# Altium schematic sheet USB-PHY.SchDoc: TE0723 - USB
size A4; Organization: Trenz Electronic GmbH; DocumentNumber: TE0723; Revision: 01; SheetNumber: 9; SheetTotal: 12; Date: 08.07.2015; Author: Indrek Tubalkain; CompanyName: Trenz Electronic GmbH; DrawnBy: Indrek Tubalkain; Engineer: Indrek Tubalkain; ProjectName: TE0723 Arduino
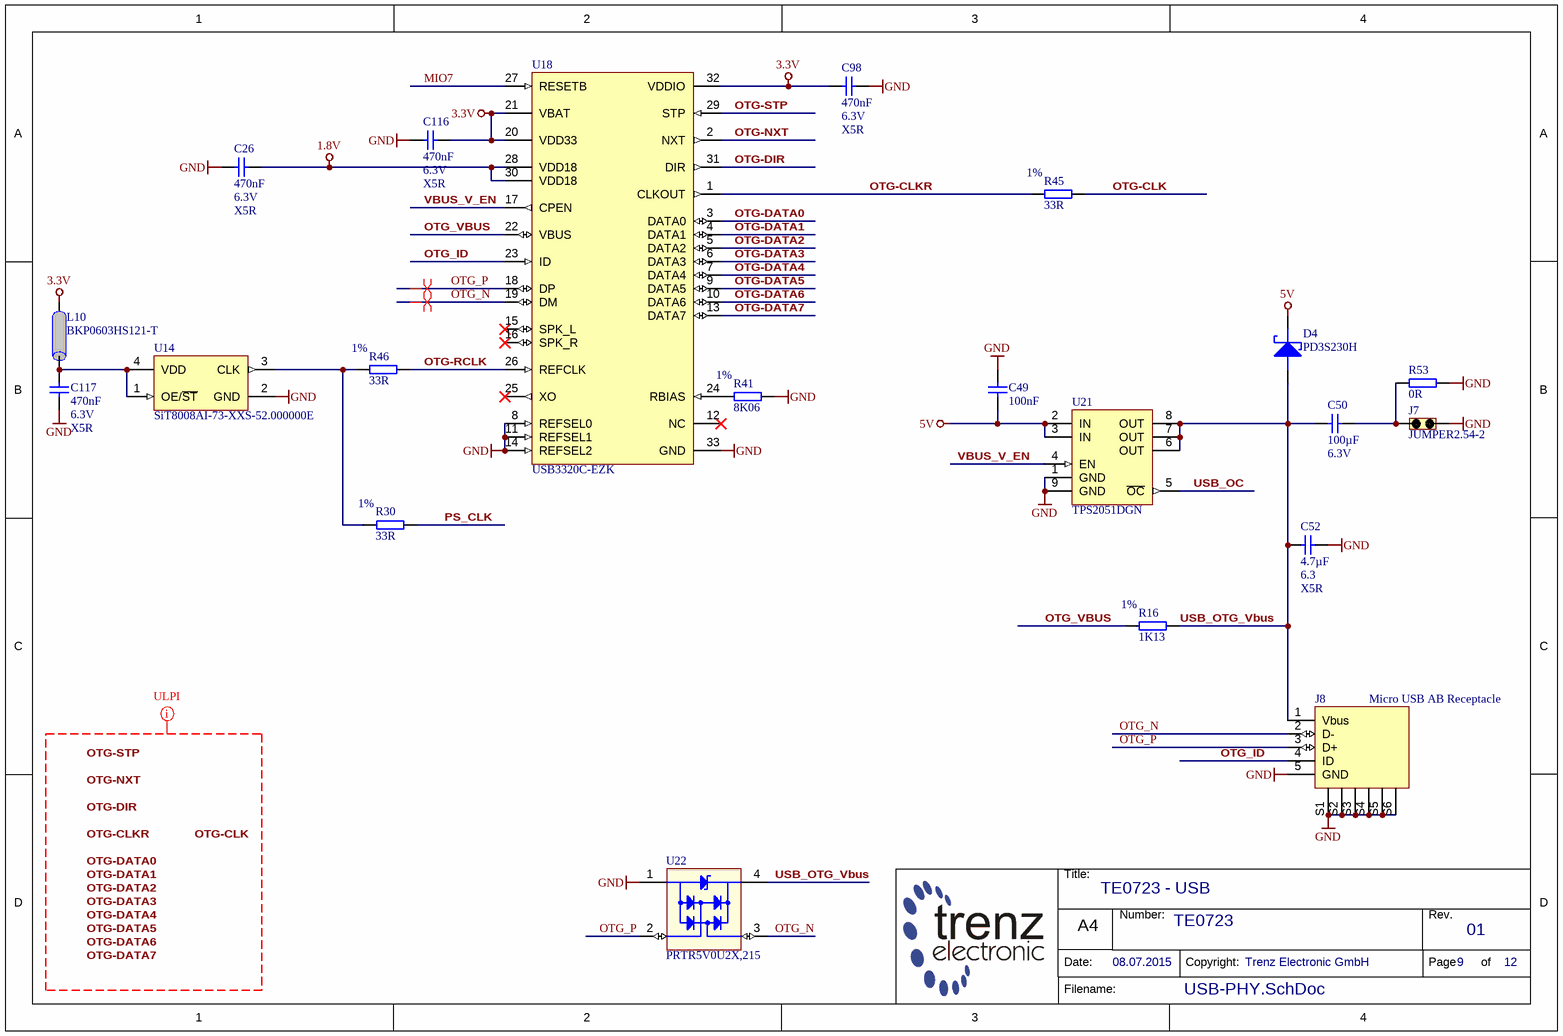
[diagram p0: USB-PHY.SchDoc]

## Parts
C26  470nF  Voltage: 6.3V  Technology: X5R  [CAPC0603X33N]
C49  100nF  [CAPC1005X55N]
C50  100µF  Voltage: 6.3V  [CAPC3216X180N]
C52  4.7µF  Voltage: 6.3  Technology: X5R  [CAPC1005X60N]
C98  470nF  Voltage: 6.3V  Technology: X5R  [CAPC0603X33N]
C116  470nF  Voltage: 6.3V  Technology: X5R  [CAPC0603X33N]
C117  470nF  Voltage: 6.3V  Technology: X5R  [CAPC0603X33N]
D4  PD3S230H  [PowerDI323]
J7  JUMPER2.54-2  [JUMPER2_54-2]
J8  Micro USB AB Receptacle  [Micro USB ZX62-xx-5PA]
L10  BKP0603HS121-T  [INDC0603X33N]
R16  1K13  Tolerance: 1%  [RESC1005X40N]
R30  33R  Tolerance: 1%  [RESC0603X26N]
R41  8K06  Tolerance: 1%  [RESC1005X40N]
R45  33R  Tolerance: 1%  [RESC0603X26N]
R46  33R  Tolerance: 1%  [RESC0603X26N]
R53  0R  [RESC1005X40N]
U14  SiT8008AI-73-XXS-52.000000E  [2016]
U18  USB3320C-EZK  [QFN50P500X500X100-33N-345]
U21  TPS2051DGN  [SOP65P488X107-9N-TI]
U22  PRTR5V0U2X,215  [SOT190P229X114-4N]

## Nets
1.8V: C26.1 U18.28(VDD18) U18.30(VDD18)
3.3V: C98.2 C116.1 L10.1 U18.20(VDD33) U18.21(VBAT) U18.32(VDDIO)
5V: C49.2 D4.1(KATHODE) U21.2(IN) U21.3(IN)
GND: C26.2 C49.1 C52.2 C98.1 C116.2 C117.2 J7.2 J8.5(GND) J8.S1 J8.S2 J8.S3 J8.S4 J8.S5 J8.S6 R41.2 R53.2 U14.2(GND) U18.8(REFSEL0) U18.11(REFSEL1) U18.14(REFSEL2) U18.33(GND) U21.1(GND) U21.9(GND) U22.1(GND)
MIO7: U18.27(RESETB)
OTG-CLK: R45.2
OTG-CLKR: R45.1 U18.1(CLKOUT)
OTG-DATA0: U18.3(DATA0)
OTG-DATA1: U18.4(DATA1)
OTG-DATA2: U18.5(DATA2)
OTG-DATA3: U18.6(DATA3)
OTG-DATA4: U18.7(DATA4)
OTG-DATA5: U18.9(DATA5)
OTG-DATA6: U18.10(DATA6)
OTG-DATA7: U18.13(DATA7)
OTG-DIR: U18.31(DIR)
OTG-NXT: U18.2(NXT)
OTG-RCLK: R46.2 U18.26(REFCLK)
OTG-STP: U18.29(STP)
OTG_ID: J8.4(ID) U18.23(ID)
OTG_N: J8.2(D-) U18.19(DM) U22.3(I/O)
OTG_P: J8.3(D+) U18.18(DP) U22.2(I/O)
OTG_VBUS: R16.1 U18.22(VBUS)
PS_CLK: R30.2
USB_OC: U21.5(~{OC})
USB_OTG_Vbus: C50.2 C52.1 D4.2(ANODE) J8.1(Vbus) R16.2 U21.6(OUT) U21.7(OUT) U21.8(OUT) U22.4(REF)
VBUS_V_EN: U18.17(CPEN) U21.4(EN)
NetC50_1: C50.1 J7.1 R53.1
NetC117_1: C117.1 L10.2 U14.1(OE/~{ST}) U14.4(VDD)
NetR30_1: R30.1 R46.1 U14.3(CLK)
NetR41_1: R41.1 U18.24(RBIAS)

Not connected (* = marked no-connect by the designer): U18 12(NC)* 15(SPK_L)* 16(SPK_R)* 25(XO)*

## Layout directives
differential pair: OTG_N, OTG_P
net class ULPI: OTG-CLK, OTG-CLKR, OTG-DATA0, OTG-DATA1, OTG-DATA2, OTG-DATA3, OTG-DATA4, OTG-DATA5, OTG-DATA6, OTG-DATA7, OTG-DIR, OTG-NXT, OTG-STP

## Notes on the sheet
- Labels drawn without touching a wire or pin: OTG-CLK, OTG-CLKR, OTG-DATA0, OTG-DATA1, OTG-DATA2, OTG-DATA3, OTG-DATA4, OTG-DATA5, OTG-DATA6, OTG-DATA7, OTG-DIR, OTG-NXT, OTG-STP
- Title:
- Number:
- Rev.
- Date:
- A4
- Copyright:
- Page
- of
- Filename:

## Library data of the parts
C26 C98 C116 C117 = 24921: KON 470nF X5R 6.3V SMD 20%; AN: 24921; Value: 470n; Mixed: SMT; Preferred: Yes; Case: 0603 (0201); Tolerance: 20%
C49 = 26183: KON 100nF 50V SMD AEC-Q200; AN: 26183; Tolerance: 10%; Mixed: SMT; Value: 100n; Case: 1005 (0402); Voltage: 50V; Technology: X7R
C50 = 23116: KON 100µF 6,3V X5R SMD 20%; AN: 23116; Mixed: SMT; Value: 100u; Preferred: Yes; Technology: X5R; Case: 3216 (1206); Tolerance: 20%
C52 = 24719: KON 4.7µF 6.3V X5R SMD 20%; AN: 24719; Mixed: SMT; Value: 4.7u; Preferred: Yes; Case: 1005 (0402); Tolerance: 20%
D4 = 24682: AN: 24682; Mixed: SMT; Case: PowerDI323; HelpURL: B:\AD\adlib\datasheet\PD3S230H
J7 = 22330: Stiftleiste gerade 1-reihig, 2pol.; AN: 22330; Mixed: THT; Trenz-Stock: Yes
J8 = 25126: Micro USB AB Buchse; AN: 25126; Mixed: SMT; Trenz-Stock: Yes; Case: Micro USB AB; HelpURL: B:\AD\adlib\datasheet\USB\USB_2.0_Spec\Micro-USB_final
L10 = 25393: Ferritdurchführung SMD 0201; AN: 25393; Mixed: SMT; Trenz-Stock: Yes; Tolerance: 25%; Case: 0603 (0201); HelpURL: B:\AD\adlib\datasheet\MULTILAYER CHIP BEAD INDUCTORS BK; Preferred: Yes
R16 = 23160: WID SMD 1K13 1% 0,063W; AN: 23160; Mixed: SMT; Value: 1.13K; Preferred: Yes; Case: 1005 (0402)
R30 R45 R46 = 25021: WID SMD 33R 1% 0,05W; AN: 25021; Value: 33; Mixed: SMT; Preferred: Yes; Case: 0603 (0201); HelpURL: B:\AD\adlib\datasheet\R0201
R41 = 25052: WID SMD 8K06 1% 0,063W; AN: 25052; Value: 8.06K; Mixed: SMT; Preferred: Yes; Case: 1005 (0402)
R53 = 26222: WID SMD 0R 1% 0.063W AEC-Q200; AN: 26222; Mixed: SMT; Value: 0; Preferred: Yes; Case: 1005 (0402)
U14 = 25009: SiT8008AI-73-XXS-52.000000E MEMS Oszillator 52MHz; AN: 25009; Value: 52M; Trenz-Stock: Yes; Mixed: SMT; Case: 2.0  x 1.6mm; HelpURL: B:\AD\adlib\datasheet\SiT8008; Preferred: Yes
U18 = 24992: AN: 24992; Trenz-Stock: Yes; Mixed: SMT; Case: QFN32; HelpURL: B:\AD\adlib\datasheet\USB3320
U21 = 25167: TPS2051BDGN; AN: 25167; Trenz-Stock: Yes; Mixed: SMT; HelpURL: B:\AD\adlib\datasheet\TPS2051BDGN; Preferred: Yes
U22 = 24840: AN: 24840; Mixed: SMT; Preferred: Yes; Case: SOT143; HelpURL: B:\AD\adlib\datasheet\CD143A-SR05